# Altium schematic sheet SUP_3.3_FMC.SchDoc
size A4; DocumentNumber: 7; SheetNumber: 7; SheetTotal: 30
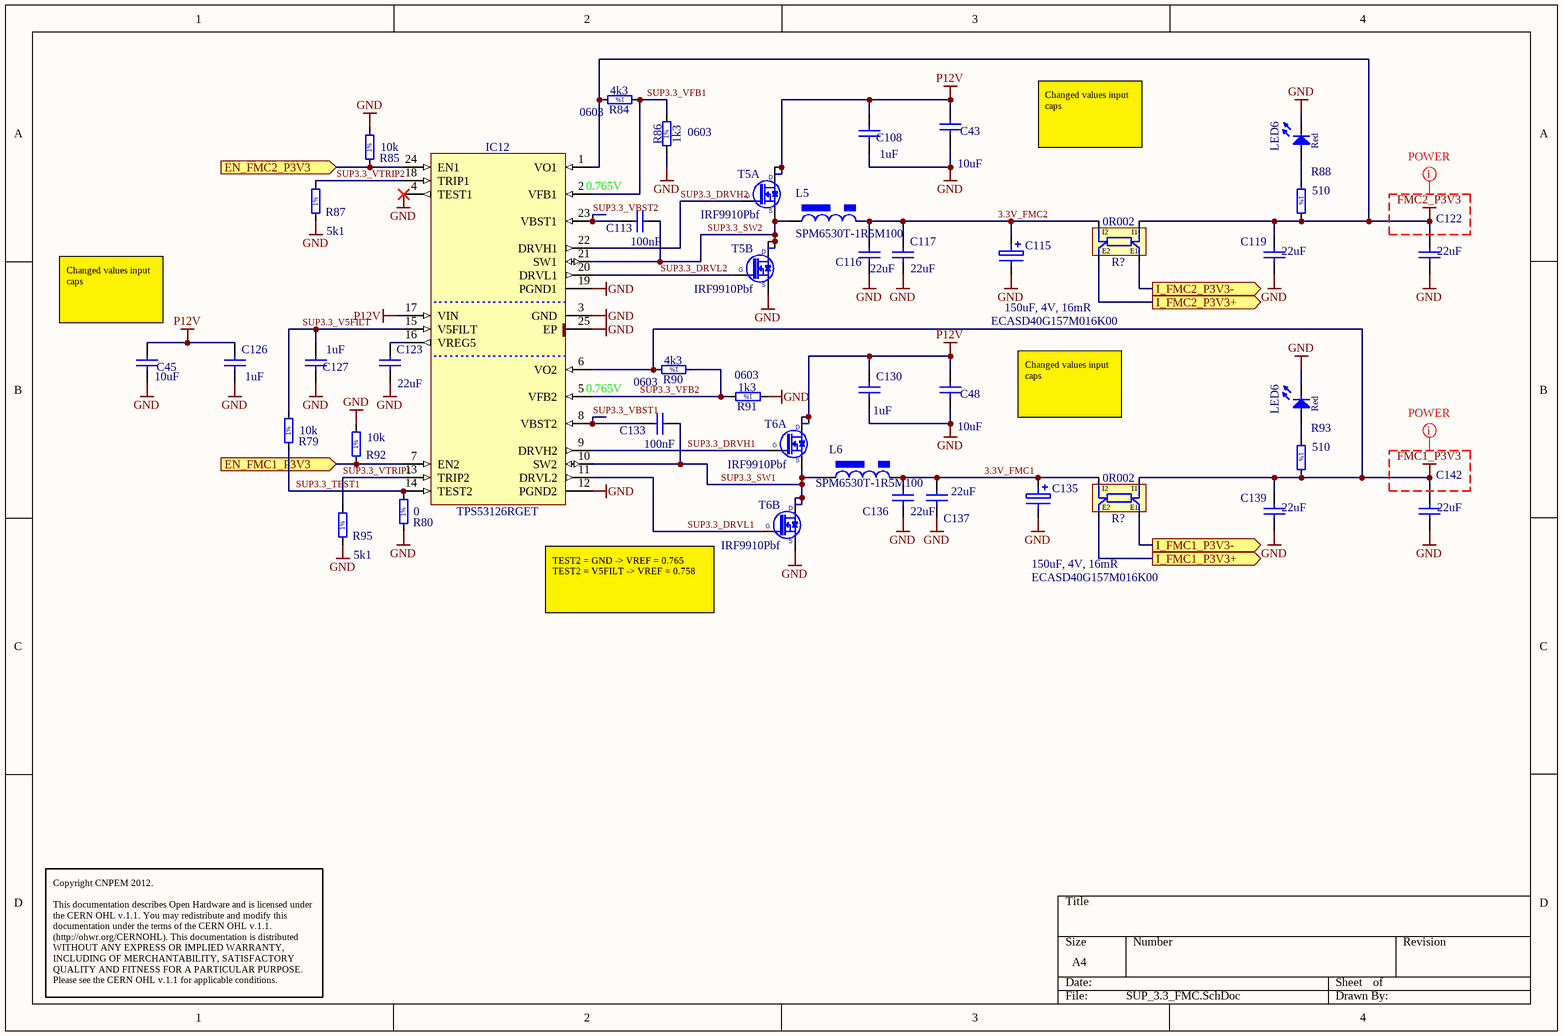
[diagram p0: SUP_3.3_FMC.SchDoc]

## Parts
(Parts that share a designator on the sheet are numbered #1, #2 ... from top to bottom, then left to right.)
C43  10uF  [CAPC2012X135N]
C45  10uF  [CAPC2012X135N]
C48  10uF  [CAPC2012X135N]
C108  1uF  [CAPC1608X87N]
C113  100nF  [CAPC1005X55N]
C115  ECASD40G157M016K00  value 150uF, 4V, 16mR  [2917_POLY]
C116  22uF  [CAPC3216X180N]
C117  22uF  [CAPC3216X180N]
C119  22uF  [CAPC3216X180N]
C122  22uF  [CAPC3216X180N]
C123  22uF  [CAPC3216X180N]
C126  1uF  [CAPC1608X87N]
C127  1uF  [CAPC1608X87N]
C130  1uF  [CAPC1608X87N]
C133  100nF  [CAPC1005X55N]
C135  ECASD40G157M016K00  value 150uF, 4V, 16mR  [2917_POLY]
C136  22uF  [CAPC3216X180N]
C137  22uF  [CAPC3216X180N]
C139  22uF  [CAPC3216X180N]
C142  22uF  [CAPC3216X180N]
IC12  TPS53126RGET  [QFN50P400X400X100-25N-S255]
L5  SPM6530T-1R5M100  [IND_TDK_SPM6530]
L6  SPM6530T-1R5M100  [IND_TDK_SPM6530]
LED6#1  Red  [LED_AVAGO_HSMC-C150]  (value not drawn)
LED6#2  Red  [LED_AVAGO_HSMC-C150]  (value not drawn)
R79  10k  [RESC1005X40N]
R80  0  [RESC1005X40N]
R84  4k3  Case: 0603  [RESC1608X55N]
R85  10k  [RESC1005X40N]
R86  1k3  Case: 0603  [RESC1608X55N]
R87  5k1  [RESC1608X55N]
R88  510  [RESC1005X40N]
R90  4k3  Case: 0603  [RESC1608X55N]
R91  1k3  Case: 0603  [RESC1608X55N]
R92  10k  [RESC1005X40N]
R93  510  [RESC1005X40N]
R95  5k1  [RESC1608X55N]
R?#1  0R002  [RES_VISHAY_WSL3637_0R002-0R01]
R?#2  0R002  [RES_VISHAY_WSL3637_0R002-0R01]
T5  IRF9910Pbf  [SOIC127P600X175-8N]  (parts A,B of 2)
T6  IRF9910Pbf  [SOIC127P600X175-8N]  (parts A,B of 2)

## Ports
EN_FMC1_P3V3 (in), EN_FMC2_P3V3 (in), I_FMC1_P3V3+ (out), I_FMC1_P3V3- (out), I_FMC2_P3V3+ (out), I_FMC2_P3V3- (out)

## Nets
FMC1_P3V3: C139.1 C142.1 IC12.6(VO2) R90.2 R93.2 R?#2.I1
FMC2_P3V3: C119.1 C122.1 IC12.1(VO1) R84.2 R88.2 R?#1.I1
GND: C43.1 C45.1 C48.1 C108.1 C115.2 C116.2 C117.2 C119.2 C122.2 C123.1 C126.1 C127.1 C130.1 C135.2 C136.2 C137.2 C139.2 C142.2 IC12.3(GND) IC12.4(TEST1) IC12.12(PGND2) IC12.19(PGND1) IC12.25(EP) LED6#1.1(C) LED6#2.1(C) R80.1 R85.2 R86.1 R87.1 R91.1 R92.2 R95.1 T5.1(S) T6.1(S)
P12V: C43.2 C45.2 C48.2 C108.2 C126.2 C130.2 IC12.17(VIN) T5.5(D) T5.6(D) T6.5(D) T6.6(D)
3.3V_FMC1: C135.1 C136.1 C137.1 L6.2 R?#2.I2
3.3V_FMC2: C115.1 C116.1 C117.1 L5.2 R?#1.I2
EN_FMC1_P3V3: IC12.7(EN2) R92.1 ; port EN_FMC1_P3V3
EN_FMC2_P3V3: IC12.24(EN1) R85.1 ; port EN_FMC2_P3V3
I_FMC1_P3V3+: R?#2.E2 ; port I_FMC1_P3V3+
I_FMC1_P3V3-: R?#2.E1 ; port I_FMC1_P3V3-
I_FMC2_P3V3+: R?#1.E2 ; port I_FMC2_P3V3+
I_FMC2_P3V3-: R?#1.E1 ; port I_FMC2_P3V3-
SUP3.3_DRVH1: IC12.9(DRVH2) T6.4(G)
SUP3.3_DRVH2: IC12.22(DRVH1) T5.4(G)
SUP3.3_DRVL1: IC12.11(DRVL2) T6.2(G)
SUP3.3_DRVL2: IC12.20(DRVL1) T5.2(G)
SUP3.3_SW1: C133.1 IC12.10(SW2) L6.1 T6.3(S) T6.7(D) T6.8(D)
SUP3.3_SW2: C113.1 IC12.21(SW1) L5.1 T5.3(S) T5.7(D) T5.8(D)
SUP3.3_TEST1: IC12.14(TEST2) R79.1 R80.2
SUP3.3_V5FILT: C127.2 IC12.15(V5FILT) R79.2
SUP3.3_VBST1: C133.2 IC12.8(VBST2)
SUP3.3_VBST2: C113.2 IC12.23(VBST1)
SUP3.3_VFB1: IC12.2(VFB1) R84.1 R86.2
SUP3.3_VFB2: IC12.5(VFB2) R90.1 R91.2
SUP3.3_VTRIP1: IC12.13(TRIP2) R95.2
SUP3.3_VTRIP2: IC12.18(TRIP1) R87.2
NetC123_2: C123.2 IC12.16(VREG5)
NetLED6#1_2: LED6#1.2(A) R88.1
NetLED6#2_2: LED6#2.2(A) R93.1

## Layout directives
net class POWER: FMC1_P3V3, FMC2_P3V3

## Notes on the sheet
- Changed values input caps
- 0.765V
- (near C45) Changed values input caps
- (near IC12) 0.765V
- TEST2 = GND -> VREF = 0.765
  TEST2 = V5FILT -> VREF = 0.758
- Copyright CNPEM 2012.
  This documentation describes Open Hardware and is licensed under the CERN OHL v.1.1. You may redistribute and modify this documentation under the terms of the CERN OHL v.1.1. (http://ohwr.org/CERNOHL). This documentation is distributed WITHOUT ANY EXPRESS OR IMPLIED WARRANTY, INCLUDING OF MERCHANTABILITY, SATISFACTORY QUALITY AND FITNESS FOR A PARTICULAR PURPOSE. Please see the CERN OHL v.1.1 for applicable conditions.
- (in symbol R0402_0R_JUMPER) 1%
- (in symbol R0402_10K_1%_0.0625W_100PPM) 1%
- (in symbol R0402_510R_1%_0.0625W_100PPM) 1%
- (in symbol R0603_1K3_1%_0.1W_100PPM) 1%
- (in symbol R0603_4K3_1%_0.1W_100PPM) 1%
- (in symbol R0603_5K1_1%_0.1W_100PPM) 1%

## Library data of the parts
C43 C45 C48 = CC0805_10UF_16V_10%_X5R: Non-polarised capacitor; Part Description: SMD Multilayer Chip Ceramic Capacitor; Manufacturer: GENERIC; Manufacturer1 Part Number: C0805C106K4PAC; Voltage: 16V; TC: X5R; Tolerance: ±10%; Table: Capacitors SMD; Part Number: CC0805_10UF_16V_10%_X5R; Component Kind: Standard; Component Type: Standard; Pin Count: 2; Value: 10uF; Status: Preferred; Manufacturer Part Number: CC0805_10UF_16V_10%_X5R; Case: 0805; Mounted: Yes; Socket: No; SMD: Yes; Manufacturer1 Example: KEMET; Manufacturer1 ComponentHeight: 1.4mm; HelpURL: \\cern.ch\dfs\Applications\Altium\Datasheets\CC1206_X5R_KEMET.pdf; Author: CERN DEM JLC; CreateDate: 2007-12-03; LatestRevisionDate: 2007-12-03
C108 C126 C127 C130 = CC0603_1UF_16V_10%_X7R: Non-polarised capacitor; Part Description: SMD Multilayer Chip Ceramic Capacitor; Manufacturer: GENERIC; Manufacturer1 Part Number: 223824613663; Voltage: 16V; TC: X7R; Tolerance: ±10%; Table: Capacitors SMD; Part Number: CC0603_1UF_16V_10%_X7R; Component Kind: Standard; Component Type: Standard; Pin Count: 2; Value: 1uF; Status: Preferred; Manufacturer Part Number: CC0603_1uF_16V_10%_X7R; Case: 0603; Mounted: Yes; Socket: No; SMD: Yes; Manufacturer1 Example: PHYCOMP; Manufacturer1 ComponentHeight: 0.87mm; HelpURL: \\cern.ch\dfs\Applications\Altium\Datasheets\CC0805_X5R_PHYCOMP_HC.pdf; Author: CERN DEM JLC; CreateDate: 2007-12-03; LatestRevisionDate: 2007-12-03
C113 C133 = CC0402_100NF_16V_10%_X7R: Non-polarised capacitor; Part Description: SMD Multilayer Chip Ceramic Capacitor; Manufacturer: GENERIC; Manufacturer1 Part Number: 223878715649; Voltage: 16V; TC: X7R; Tolerance: ±10%; Table: Capacitors SMD; Part Number: CC0402_100NF_16V_10%_X7R; Component Kind: Standard; Component Type: Standard; Pin Count: 2; Value: 100nF; Status: Not Recommended; Manufacturer Part Number: CC0402_100NF_16V_10%_X7R; Case: 0402; Mounted: Yes; Socket: No; SMD: Yes; Manufacturer1 Example: PHYCOMP; Manufacturer1 ComponentHeight: 0.55mm; HelpURL: \\cern.ch\dfs\Applications\Altium\Datasheets\CC0402_X7R_PHYCOMP.pdf; Author: CERN DEM JLC; CreateDate: 2007-12-03; LatestRevisionDate: 2007-12-03
C115 C135 = CAP_POLYMER_SMDD: POLY, 150uF, 4V, ESR: 16mR
C116 C117 C119 C122 C123 C136 C137 C139 C142 = CC1206_22UF_10V_10%_X7R: Non-polarised capacitor; Part Description: SMD Multilayer Chip Ceramic Capacitor; Manufacturer: GENERIC; Manufacturer1 Part Number: GRM31CR71A226KE15L; Voltage: 10V; TC: X7R; Tolerance: ±10%; Table: Capacitors SMD; Part Number: CC1206_22UF_10V_10%_X7R; Component Kind: Standard; Component Type: Standard; Pin Count: 2; Value: 22uF; Status: Preferred; Manufacturer Part Number: CC1206_22UF_10V_10%_X7R; Case: 1206; Mounted: Yes; Socket: No; SMD: Yes; Manufacturer1 Example: MURATA; Manufacturer1 ComponentHeight: 1.8mm; HelpURL: \\cern.ch\dfs\Applications\Altium\Datasheets\CC1206_X7R_MURATA_GRM-HI-CAP.pdf; Author: CERN DEM JLC; CreateDate: 2010-06-08; LatestRevisionDate: 2010-06-08
IC12 = TPS53126RGET: Dual Synchronous Step-Down Controller For Low Voltage Power Rails; Manufacturer: TEXAS INSTRUMENTS; Table: Analog & Interface; Part Number: TPS53126RGET; Component Kind: Standard; Component Type: Standard; Device: TPS53126RGET; PackageDescription: QFN,0.50mm pitch,square;6 pin X 6 pin,4.15mm X 4.15mm X 1.00mm H body (w/thermal tab 2.55 X 2.55mm),  IPC Medium Density; Part Description: Dual Synchronous Step-Down Controller For Low Voltage Power Rails; Manufacturer Part Number: TPS53126RGET; Pin Count: 25; Case: QFN24; Mounted: Yes; Socket: No; SMD: Yes; ComponentHeight: 1.0mm; Author: CERN DEM JLC; HelpURL: \\cern.ch\dfs\Applications\Altium\Datasheets\TPS53126RGET.pdf; CreateDate: 2010-08-26; LatestRevisionDate: 2010-08-26
L5 L6 = L_POWER_SPM6530T: 1.5uH, 20%, 10mR, 11.5A; Supplier 1: Arrow; Supplier Part Number 1: 51419938S48550N1165
LED6#1 LED6#2 = LED_AVAGO_HSMC-C150: LED Red 1C 2A; Part Description: Surface Mount Red LED (1206 Case); Manufacturer: AVAGO TECHNOLOGIES; PressFit: No; Bonding: No; Part Number: LED_AVAGO_HSMC-C150; Component Kind: Standard; Component Type: Standard; Color: Red; PackageDescription: Red Chip LED, 2-Leads, Body 3.2 x1.6mm, IPC Medium Density; Manufacturer Part Number: HSMC-C150; Pin Count: 2; Case: 1206; Mounted: Yes; Socket: No; SMD: Yes; Sense: No; ComponentHeight: 1.2mm; HelpURL: \\cern.ch\dfs\Applications\Altium\Datasheets\LED_AVAGO_HSMC-C150.pdf; Author: CERN DEM JLC; CreateDate: 18/06/2013; LatestRevisionDate: 18/06/2013
R79 R85 R92 = R0402_10K_1%_0.0625W_100PPM: Resistor - 1%; Part Description: General Purpose Thick Film Chip Resistor; Manufacturer: GENERIC; Manufacturer1 Part Number: 232270671003L; TC: ±100ppm/°C; Table: Resistors SMD; Part Number: R0402_10K_1%_0.0625W_100PPM; Component Kind: Standard; Component Type: Standard; Pin Count: 2; Value: 10k; Status: Not recommended; Power: 0.0625W; Tolerance: ±1%; Manufacturer Part Number: R0402_10K_1%_0.0625W_100PPM; Case: 0402; Mounted: Yes; Socket: No; SMD: Yes; Manufacturer1 Example: YAGEO PHYCOMP; Manufacturer1 ComponentHeight: 0.4mm; HelpURL: \\cern.ch\dfs\Applications\Altium\Datasheets\R0402_Phycomp_RC0402.pdf; Author: CERN DEM JLC; CreateDate: 2007-12-03; LatestRevisionDate: 2012-10-17
R80 = R0402_0R_JUMPER: Resistor - 1%; Part Description: 1A (0.05R Max DC Resistance) Zero Ohm Jumper; Manufacturer: GENERIC; Manufacturer1 Part Number: 232270591001L; Table: Resistors SMD; Part Number: R0402_0R_JUMPER; Component Kind: Standard; Component Type: Standard; Pin Count: 2; Value: 0; Status: Not recommended; Manufacturer Part Number: R0402_0R_JUMPER; Case: 0402; Mounted: Yes; Socket: No; SMD: Yes; Manufacturer1 Example: YAGEO PHYCOMP; Manufacturer1 ComponentHeight: 0.4mm; HelpURL: \\cern.ch\dfs\Applications\Altium\Datasheets\R0402_Phycomp_RC0402.pdf; Author: CERN DEM JLC; CreateDate: 2007-12-03; LatestRevisionDate: 2012-10-17
R84 R90 = R0603_4K3_1%_0.1W_100PPM: Resistor - 1%; Part Description: General Purpose Thick Film Chip Resistor; Manufacturer: GENERIC; Manufacturer1 Part Number: NRC06F4301TRF; Power: 0.1W; TC: ±100ppm/°C; Table: Resistors SMD; Part Number: R0603_4K3_1%_0.1W_100PPM; Component Kind: Standard; Component Type: Standard; Pin Count: 2; Value: 4k3; Status: Preferred; Tolerance: ±1%; Manufacturer Part Number: R0603_4K3_1%_0.1W_100PPM; Mounted: Yes; Socket: No; SMD: Yes; Manufacturer1 Example: NIC COMPONENT; Manufacturer1 ComponentHeight: 0.55mm; HelpURL: \\cern.ch\dfs\Applications\Altium\Datasheets\R0603_NIC_NRC.pdf; Author: CERN DEM JLC; CreateDate: 2007-12-03; LatestRevisionDate: 2008-03-13
R86 R91 = R0603_1K3_1%_0.1W_100PPM: Resistor - 1%; Part Description: General Purpose Thick Film Chip Resistor; Manufacturer: GENERIC; Manufacturer1 Part Number: NRC06F1301TRF; Power: 0.1W; TC: ±100ppm/°C; Table: Resistors SMD; Part Number: R0603_1K3_1%_0.1W_100PPM; Component Kind: Standard; Component Type: Standard; Pin Count: 2; Value: 1k3; Status: Preferred; Tolerance: ±1%; Manufacturer Part Number: R0603_1K3_1%_0.1W_100PPM; Mounted: Yes; Socket: No; SMD: Yes; Manufacturer1 Example: NIC COMPONENT; Manufacturer1 ComponentHeight: 0.55mm; HelpURL: \\cern.ch\dfs\Applications\Altium\Datasheets\R0603_NIC_NRC.pdf; Author: CERN DEM JLC; CreateDate: 2007-12-03; LatestRevisionDate: 2008-03-13
R87 R95 = R0603_5K1_1%_0.1W_100PPM: Resistor - 1%; Part Description: General Purpose Thick Film Chip Resistor; Manufacturer: GENERIC; Manufacturer1 Part Number: NRC06F5101TRF; Power: 0.1W; TC: ±100ppm/°C; Table: Resistors SMD; Part Number: R0603_5K1_1%_0.1W_100PPM; Component Kind: Standard; Component Type: Standard; Pin Count: 2; Value: 5k1; Status: Preferred; Tolerance: ±1%; Manufacturer Part Number: R0603_5K1_1%_0.1W_100PPM; Case: 0603; Mounted: Yes; Socket: No; SMD: Yes; Manufacturer1 Example: NIC COMPONENT; Manufacturer1 ComponentHeight: 0.55mm; HelpURL: \\cern.ch\dfs\Applications\Altium\Datasheets\R0603_NIC_NRC.pdf; Author: CERN DEM JLC; CreateDate: 2007-12-03; LatestRevisionDate: 2008-03-13
R88 R93 = R0402_510R_1%_0.0625W_100PPM: Resistor - 1%; Part Description: General Purpose Thick Film Chip Resistor; Manufacturer: GENERIC; Manufacturer1 Part Number: 232270675101L; TC: ±100ppm/°C; Table: Resistors SMD; Part Number: R0402_510R_1%_0.0625W_100PPM; Component Kind: Standard; Component Type: Standard; Pin Count: 2; Value: 510; Status: Not recommended; Power: 0.0625W; Tolerance: ±1%; Manufacturer Part Number: R0402_510R_1%_0.0625W_100PPM; Case: 0402; Mounted: Yes; Socket: No; SMD: Yes; Manufacturer1 Example: YAGEO PHYCOMP; Manufacturer1 ComponentHeight: 0.4mm; HelpURL: \\cern.ch\dfs\Applications\Altium\Datasheets\R0402_Phycomp_RC0402.pdf; Author: CERN DEM JLC; CreateDate: 2007-12-03; LatestRevisionDate: 2012-10-17
R?#1 R?#2 = R3637_0R002_1%_3W_50PPM_VISHAY_WSL3637: Power and Current Sensing Resistor; Part Description: Power Metal Strip® Resistor, Low Value; Manufacturer: VISHAY DALE; Manufacturer Part Number: WSL36372L000FEA; Power: 3W; TC: ±75ppm/°C; Tolerance: ±1%; Part Number: R3637_0R002_1%_3W_50PPM_VISHAY_WSL3637; Component Kind: Standard; Component Type: Standard; Pin Count: 2; Value: 0R002; Status: None; Case: 3637; Mounted: Yes; Sense: No; Socket: No; SMD: Yes; ComponentHeight: 0.89mm; HelpURL: \\cern.ch\dfs\Applications\Altium\Datasheets\R3637_VISHAY_WSL3637.pdf; Author: CERN DEM MR; CreateDate: 02/06/2016; LatestRevisionDate: 02/06/2016
T5 T6 = IRF9910Pbf: Dual SO-8 MOSFET For POL Cconverter; Part Description: 20V 10A(Q1) 20V 12A (Q2) Dual SO-8 MOSFET For POL Cconverter; Manufacturer: INTERNATIONAL RECTIFIER; Table: Transistors; Part Number: IRF9910Pbf; Component Kind: Standard; Component Type: Standard; Device: IRF9910Pbf; PackageDescription: SOIC 8, Pitch 1.27mm - Body 4x5mm, IPC Medium Density; Manufacturer Part Number: IRF9910Pbf; Pin Count: 8; Case: DO8; Mounted: Yes; Socket: No; SMD: Yes; ComponentHeight: 1.75mm; HelpURL: \\cern.ch\dfs\Applications\Altium\Datasheets\IRF9910Pbf.pdf; Author: CERN DEM JLC; CreateDate: 2010-08-30; LatestRevisionDate: 2010-08-30